# EAGLE design NSL_Kraken (EAGLE 5.11)
MPN: MCL-S250SRC; OC_NEWARK: 14N9351
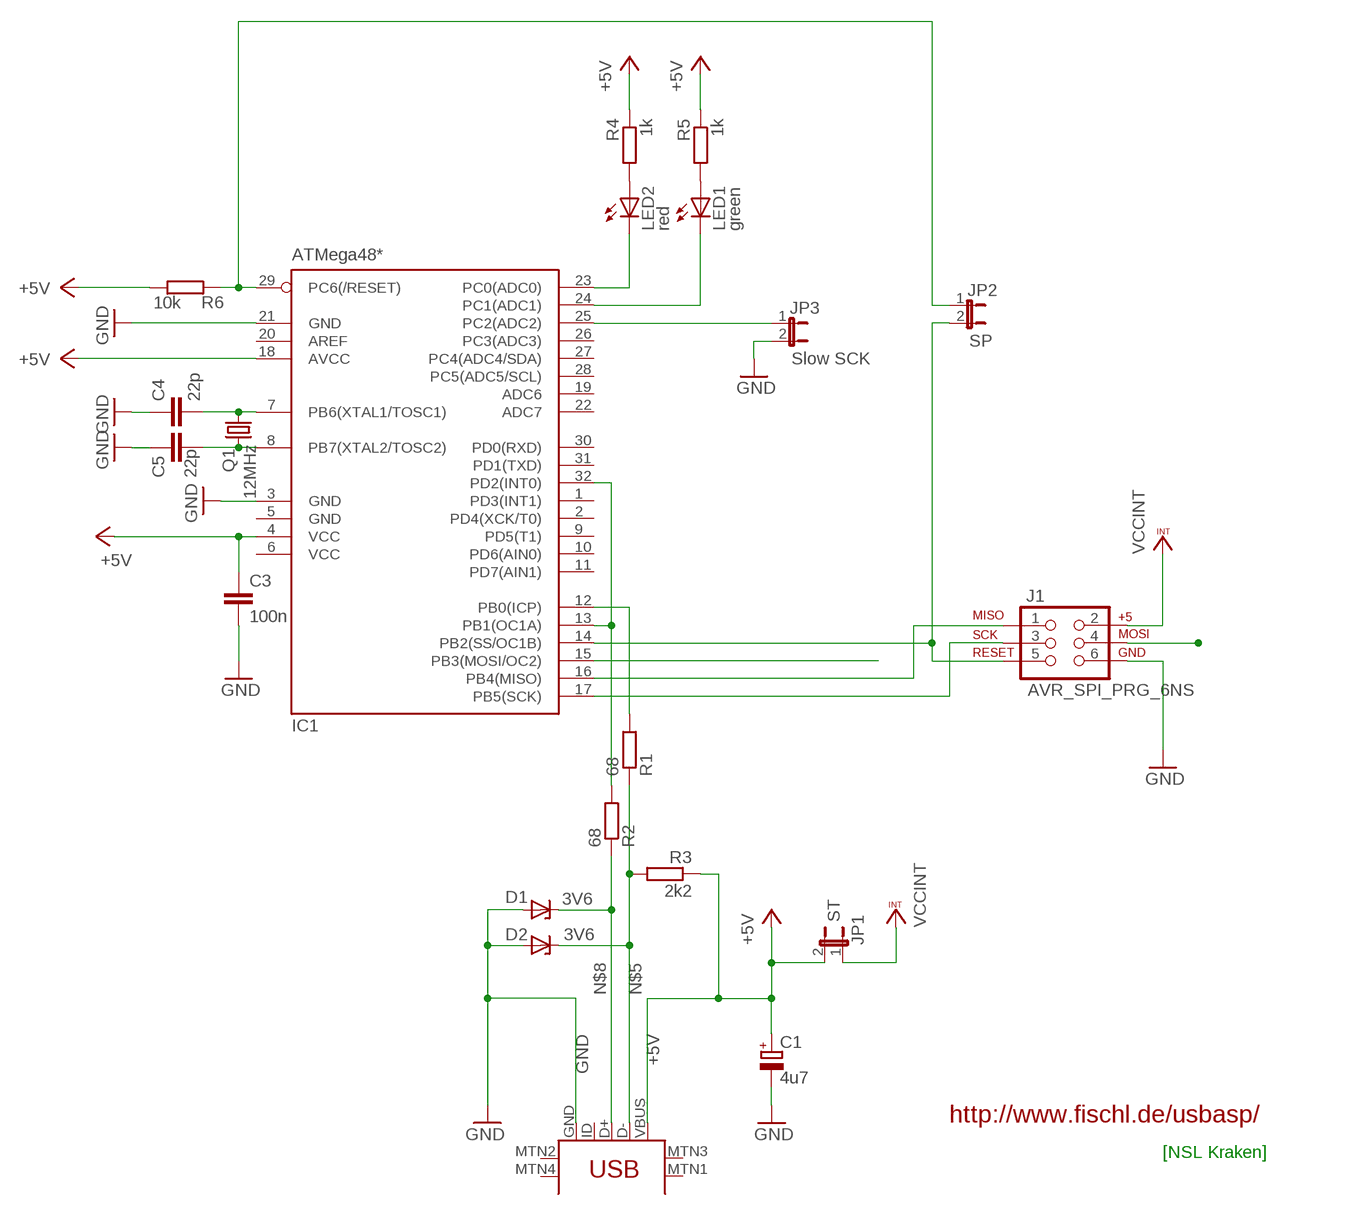
[diagram p0: schematic, sheet 1]

## Parts
C1  4u7  CPOL-EUR/2012-12R  [R/2012-12R]
C3  100n  C-EUC0805  [C0805]
C4  22p  C-EUC0805  [C0805]
C5  22p  C-EUC0805  [C0805]
D1  3V6  ZENER-DIODESOD80C  [SOD80C]
D2  3V6  ZENER-DIODESOD80C  [SOD80C]
IC1  ATMega48*  MEGA8-AI  [TQFP32-08]
J1  AVR_SPI_PRG_6NS  [2X3-NS]
JP1  ST  JP1E  [JP1]
JP2  SP  JP1E  [JP1]
JP3  Slow SCK  JP1E  [JP1]
LED1  green  LEDSMT1206  [1206]
LED2  red  LEDSMT1206  [1206]
Q1  12MHz  CRYTALSM49  [SM49]
R1  68  R-EU_R0805  [R0805]
R2  68  R-EU_R0805  [R0805]
R3  2k2  R-EU_R0805  [R0805]
R4  1k  R-EU_R0805  [R0805]
R5  1k  R-EU_R0805  [R0805]
R6  10k  R-EU_R0805  [R0805]
U$1  USB-MINIB-5PIN  [USB-MINIB]

## Nets
+5V: C1.+ C3.1 IC1.4(VCC) IC1.18(AVCC) JP1.2 R3.1 R4.1 R5.1 R6.1 U$1.VBUS
GND: C1.- C3.2 C4.1 C5.1 D1.A D2.A IC1.3(GND) IC1.21(GND) J1.6 JP3.2 U$1.GND
MISO: IC1.16(PB4(MISO)) J1.1
MOSI: IC1.15(PB3(MOSI/OC2)) J1.4
N$1: IC1.29(PC6(/RESET)) JP2.1 R6.2
N$5: D2.C R1.1 R3.2 U$1.D-
N$7: IC1.13(PB1(OC1A)) IC1.32(PD2(INT0)) R2.2
N$8: D1.C R2.1 U$1.D+
N$12: IC1.25(PC2(ADC2)) JP3.1
N$13: LED2.A R4.2
N$14: IC1.23(PC0(ADC0)) LED2.C
N$15: IC1.24(PC1(ADC1)) LED1.C
N$16: IC1.12(PB0(ICP)) R1.2
N$22: C4.2 IC1.7(PB6(XTAL1/TOSC1)) Q1.2
N$23: C5.2 IC1.8(PB7(XTAL2/TOSC2)) Q1.1
N$25: LED1.A R5.2
RST: IC1.14(PB2(SS/OC1B)) J1.5 JP2.2
SCK: IC1.17(PB5(SCK)) J1.3
VCCINT: J1.2 JP1.1
Unconnected: IC1.1(PD3(INT1)) IC1.2(PD4(XCK/T0)) IC1.9(PD5(T1)) IC1.10(PD6(AIN0)) IC1.11(PD7(AIN1)) IC1.19(ADC6) IC1.20(AREF) IC1.22(ADC7) IC1.26(PC3(ADC3)) IC1.27(PC4(ADC4/SDA)) IC1.28(PC5(ADC5/SCL)) IC1.30(PD0(RXD)) IC1.31(PD1(TXD)) U$1.ID U$1.MTN1(MTN2) U$1.MTN2(MTN3) U$1.MTN3(MTN1) U$1.MTN4

## Notes on the sheet
- http://www.fischl.de/usbasp/
- [NSL Kraken]

## Power pins joined to a net without a drawn wire
GND: IC1.5(GND)
VCC: IC1.6(VCC)

## Library data of the parts
C1 = rcl:CPOL-EU: POLARIZED CAPACITOR, European symbol
C3-C5 = rcl:C-EU: CAPACITOR, European symbol
D1 D2 = diode:ZENER-DIODE: Z-Diode
IC1 = atmel:MEGA8: MICROCONTROLLER 8 Kbytes FLASH, 1 kbytes SRAM, 512 bytes EEPROM, USART, 6-channel 10 bit ADC, 2-channel 8 bit ADC Pin compatible with Atmega48, ATMega88, ATMega168 Source: avr.lbr; MPN: ATMEGA8-16AU; OC_FARNELL: 9171371; OC_NEWARK: 73M8863
J1 = SparkFun:AVR_SPI_PRG_6: AVR ISP 6 Pin This is the reduced ISP connector for AVR programming. Common on Arduino. This footprint will take up less PCB space and can be used with a 10-pin to 6-pin adapter such as SKU: BOB-08508
JP1-JP3 = jumper:JP1E: JUMPER
LED1 LED2 = led:LED: LED OSRAM: - CHIPLED LG R971, LG N971, LY N971, LG Q971, LY Q971, LO R971, LY R971 LH N974, LH R974 LS Q976, LO Q976, LY Q976 LO Q996 - Hyper CHIPLED LW Q18S LB Q993, LB Q99A, LB R99A - SideLED LS A670, LO A670, LY A670, LG A670, LP A670 LB A673, LV A673, LT A673, LW A673 LH A674 LY A675 LS A676, LA A676, LO A676, LY A676, LW A676 LS A679, LY A679, LG A679 - Hyper Micro SIDELED® LS Y876, LA Y876, LO Y876, LY Y876 LT Y87S - SmartLED LW L88C, LW L88S LB L89C, LB L89S, LG L890 LS L89K, LO L89K, LY L89K LS L896, LA L896, LO L896, LY L896 - TOPLED LS T670, LO T670, LY T670, LG T670, LP T670 LSG T670, LSP T670, LSY T670, LOP T670, LYG T670 LG T671, LOG T671, LSG T671 LB T673, LV T673, LT T673, LW T673 LH T674 LS T676, LA T676, LO T676, LY T676, LB T676, LH T676, LSB T676, LW T676 LB T67C, LV T67C, LT T67C, LS T67K, LO T67K, LY T67K, LW E67C LS E67B, LA E67B, LO E67B, LY E67B, LB E67C, LV E67C, LT E67C LW T67C LS T679, LY T679, LG T679 LS T770, LO T770, LY T770, LG T770, LP T770 LB T773, LV T773, LT T773, LW T773 LH T774 LS E675, LA E675, LY E675, LS T675 LS T776, LA T776, LO T776, LY T776, LB T776 LHGB T686 LT T68C, LB T68C - Hyper Mini TOPLED® LB M676 - Mini TOPLED Santana® LG M470 LS M47K, LO M47K, LY M47K Source: http://www.osram.convergy.de LUXEON: - LUMILED® LXK2-PW12-R00, LXK2-PW12-S00, LXK2-PW14-U00, LXK2-PW14-V00 LXK2-PM12-R00, LXK2-PM12-S00, LXK2-PM14-U00 LXK2-PE12-Q00, LXK2-PE12-R00, LXK2-PE12-S00, LXK2-PE14-T00, LXK2-PE14-U00 LXK2-PB12-K00, LXK2-PB12-L00, LXK2-PB12-M00, LXK2-PB14-N00, LXK2-PB14-P00, LXK2-PB14-Q00 LXK2-PR12-L00, LXK2-PR12-M00, LXK2-PR14-Q00, LXK2-PR14-R00 LXK2-PD12-Q00, LXK2-PD12-R00, LXK2-PD12-S00 LXK2-PH12-R00, LXK2-PH12-S00 LXK2-PL12-P00, LXK2-PL12-Q00, LXK2-PL12-R00 Source: www.luxeon.com KINGBRIGHT: KA-3528ASYC Source: www.kingbright.com
Q1 = crystal:CRYTAL: CRYSTAL
R1-R6 = rcl:R-EU_: RESISTOR, European symbol
U$1 = SparkFun:USB-MINIB: Mini-USB "B" connector with 5th pin broken out. Created new symbol breaking out 5th "ID" pin in mini/micro USB connector spec. See: http://en.wikipedia.org/wiki/Mini_usb#Cables. Uses same footprint as 4-pin symbol. Also added pins to connect to mounting / shield pads if required (probably not generally needed as signals aren't shielded once they leave the connector).

## Net classes
0 default: width 0.254 mm

## Board
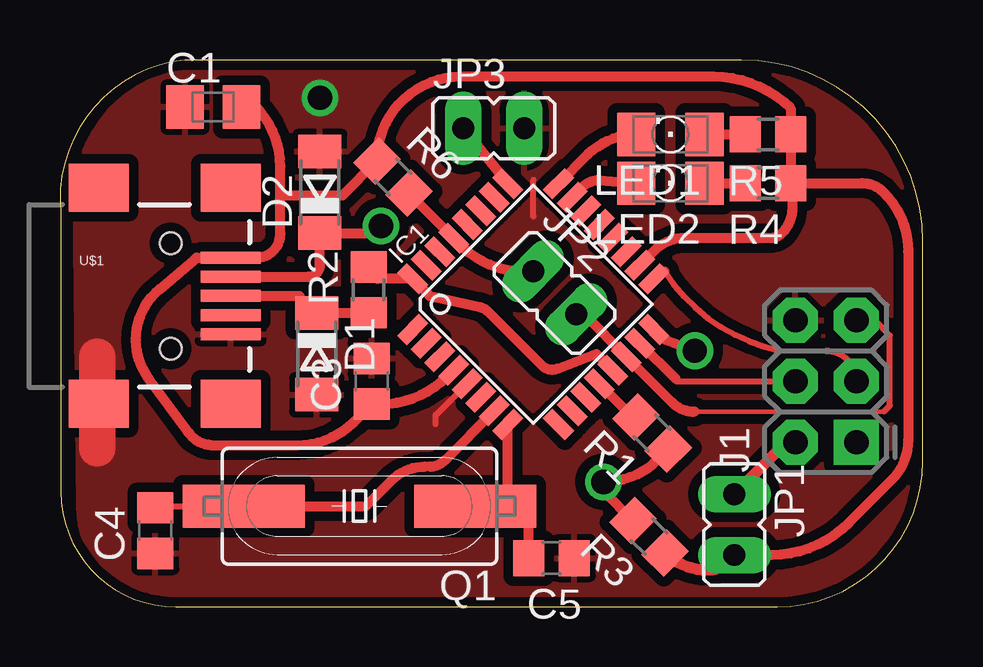
[diagram p1: board, top side]
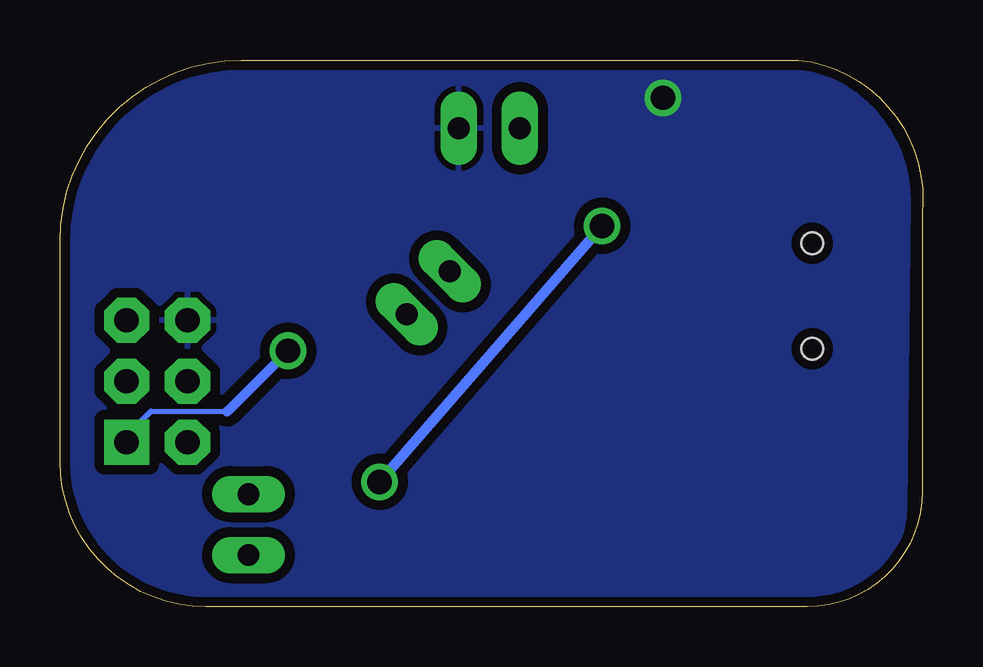
[diagram p2: board, bottom side, seen from below]

Size 35.95 x 22.78 mm. Coordinates in mm from the lower left corner, seen from the top.
Outline: 29.88,0 arc90 35.95,6.07 35.95,15.22 arc90 28.39,22.78 5.19,22.78 arc90 0.03,16.35 0.03,4.79 arc90 4.83,0 29.88,0
Copper layers (1*16): Top 0.0356mm / dielectric 1.5011mm / Bottom 0.0356mm
Design rules "SparkFun-mod *": minimum track width 8mil, minimum drill 32mil, track to track 12mil, track to pad 12mil, pad to pad 8mil, via to via 8mil, smd to smd 8mil, copper to edge 12mil, drill to drill 8mil, minimum pad ring 12mil, minimum via ring 10mil, stop-mask expansion 4mil, vias tented up to drill 25mil, thermal gap 10mil
Milling: 8 lines

### Footprints (pad centres in the part's own frame; a part is rotated, then mirrored left to right if it is on the bottom)
R/2012-12R = smd 1.55 x 1.8: + 1.175,0; - -1.175,0
C0805 = smd 1.3 x 1.5: 1 -0.95,0; 2 0.95,0
SOD80C = smd 1.4 x 1.8: A 1.7,0; C -1.7,0
TQFP32-08 = smd 1.27 x 0.559: 1 -4.293,2.8; 2 -4.293,2; 3 -4.293,1.2; 4 -4.293,0.4; 5 -4.293,-0.4; 6 -4.293,-1.2; 7 -4.293,-2; 8 -4.293,-2.8; 17 4.293,-2.8; 18 4.293,-2; 19 4.293,-1.2; 20 4.293,-0.4; 21 4.293,0.4; 22 4.293,1.2; 23 4.293,2; 24 4.293,2.8 | smd 0.559 x 1.27: 9 -2.8,-4.293; 10 -2,-4.293; 11 -1.2,-4.293; 12 -0.4,-4.293; 13 0.4,-4.293; 14 1.2,-4.293; 15 2,-4.293; 16 2.8,-4.293; 25 2.8,4.293; 26 2,4.293; 27 1.2,4.293; 28 0.4,4.293; 29 -0.4,4.293; 30 -1.2,4.293; 31 -2,4.293; 32 -2.8,4.293
2X3-NS = drill 1.016 pad 1.88 square: 1 -2.54,-1.27 | drill 1.016 pad 1.88 octagon: 2 -2.54,1.27; 3 0,-1.27; 4 0,1.27; 5 2.54,-1.27; 6 2.54,1.27
JP1 = drill 0.914 long: 1 0,-1.27; 2 0,1.27
1206 = smd 1.6 x 1.803: A -1.422,0; C 1.422,0
SM49 = smd 5.08 x 1.778: 1 -4.826,0; 2 4.826,0
R0805 = smd 1.3 x 1.5: 1 -0.95,0; 2 0.95,0
USB-MINIB = smd 2.5 x 0.5: D+ 2.5,0; D- 2.5,0.8; GND 2.5,-1.6; ID 2.5,-0.8; VBUS 2.5,1.6 | smd 2.5 x 2: MTN1 -3,4.5; MTN2 2.5,4.5; MTN3 -3,-4.5; MTN4 2.5,-4.5 | hole 0.9: 0,2.2; 0,-2.2

### Placement (x,y rotation side)
C1  6.38,20.83 0 top
C3  12.99,9.4 90 top
C4  3.97,3.18 90 top
C5  20.48,2.03 180 top
D1  10.7,10.54 270 top
D2  10.83,17.27 90 top
IC1  19.72,12.61 45 top
J1  31.91,9.4 90 top
JP1  28.1,3.43 180 top
JP2  20.61,13.08 225 top
JP3  18.07,19.94 270 top
LED1  25.43,19.69 180 top
LED2  25.43,17.65 180 top
Q1  12.48,4.19 180 top
R1  24.67,7.24 135 top
R2  12.86,13.21 90 top
R3  24.54,2.92 135 top
R4  29.5,17.65 180 top
R5  29.5,19.69 180 top
R6  13.88,17.91 315 top
U$1  4.61,12.95 0 top

### Tracks (layer width: path | path; a pad name or v marks a point on that pad's centre or on a via)
+5V
  Top 0.254: 16.5,9.86 IC1.4 16.14,9.6 | C3.1 13.35,8.45 | R4.1 30.51,17.59 | U$1.VBUS 8.2,14.55 | IC1.18 24.16,14.25 24.27,14.35
  Top 0.406: U$1.VBUS 5.7,14.55 4.15,13.24 arc50 3.16,11.12 arc36 3.68,9.53 5.34,7.27 arc54 6.4,6.73 9.88,6.73 arc45 12.26,7.72 C3.1 | 13.35,8.45 arc45 16.14,9.6 | C1.+ 8.16,20.83 arc-45 9.18,18.38 9.18,17.15 | 9.18,17.15 11.77,17.15 R6.1 arc-90 16.72,22.1 27.23,22.1 arc-45 30.45,20.77 R5.1 R4.1 33.42,17.65 arc-45 34.31,17.29 arc-45 35.34,14.8 35.34,6.95 arc-45 34.64,5.27 32.86,3.49 arc-45 29.64,2.16 JP1.2 27.82,1.88 | 30.51,17.59 30.51,16.63 arc-45 30.07,15.56 arc-45 29.61,15.37 26.04,15.37 arc45 24.75,14.83 24.27,14.35 | 9.18,17.15 9.18,15.53 arc-90 8.2,14.55
  Top 0.457: 27.82,1.88 arc-45 26.97,1.52 arc-45 R3.1
GND  (via drill 1.02)
  Top 0.254: 19.72,16.26 19.72,17.78 | D1.A 10.75,9.14 | 15.83,10.34 IC1.3 | 16.54,8.87 IC1.5 15.65,7.98 15.65,7.62
  Top 1.524: 1.56,6.6 1.56,10.41
  other vias: 10.83,21.21
  pour Top (isolate 0.406): 35.54,15.76 arc89 28.73,22.48 6.17,22.48 arc91 0.61,16.85 0.75,4.17 arc89 4.72,0.25 31.01,0.25 arc91 35.66,4.95
  pour Bottom (isolate 0.406): 35.41,16.4 arc89 29.26,22.47 6.17,22.48 arc91 0.61,16.85 0.75,4.18 arc89 4.71,0.26 30.96,0.26 arc91 35.54,4.88
MISO  (via drill 1.02)
  Top 0.406: IC1.16 25.11,11.18 v26.45,10.67
  Bottom 0.203: 28.99,8.13 32.16,8.13
  Bottom 0.254: 32.16,8.13 33.18,7.11 J1.1
  Bottom 0.406: v26.45,10.67 28.99,8.13
MOSI
  Top 0.254: 25.65,9.51 25.65,9.44 25.69,9.4 J1.4
  Top 0.406: IC1.15 25.65,9.51
N$1
  Top 0.254: 16.79,14.97 IC1.29 16.4,15.39 | 19.55,13.98 JP2.1 | R6.2 14.55,17.21
  Top 0.406: 16.79,14.97 arc45 19.55,13.98 | 14.55,17.21 IC1.29
N$5  (via drill 1.02)
  Top 0.406: 23.57,3.72 R3.2 22.64,4.83 v22.64,5.21 arc45 24.93,6.16 R1.1 | U$1.D- 10.36,13.75 arc90 10.83,14.22 D2.C 13.07,15.57 v13.37,15.88
  Bottom 0.406: v13.37,15.88 v22.64,5.21
N$7
  Top 0.254: IC1.32
  Top 0.406: IC1.32 15.4,12.95 17.47,12.5 arc-32 17.85,12.29 20.06,10.07 arc66 20.74,9.93 22.35,10.54 IC1.13 | R2.2 13.23,13.67 IC1.32
N$8
  Top 0.254: 10.46,12.26 D1.C 9.99,12.95
  Top 0.406: 10.46,12.26 R2.1 | U$1.D+ 9.99,12.95
N$12
  Top 0.406: JP3.1 IC1.25
N$13
  Top 0.406: LED2.A R4.2
N$14
  Top 0.406: IC1.23 21.75,17.48 arc-45 22.49,17.78 LED2.C
N$15
  Top 0.406: IC1.24 21.99,18.85 arc-45 LED1.C
N$16
  Top 0.254: 23.85,7.91 R1.2
  Top 0.406: IC1.12 23.85,7.91
N$22
  Top 0.254: C4.2 4.04,4.19 Q1.2 | 15.21,5.84 15.4,5.84
  Top 0.406: Q1.2 12.73,4.19 13.8,5.26 arc-45 15.21,5.84 | 15.4,5.84 arc45 16.04,6.11 IC1.7
N$23
  Top 0.254: 19.53,4.19 19.08,4.19 18.66,4.62
  Top 0.406: C5.2 19.53,4.19 | 19.08,4.19 Q1.1 | 18.66,4.62 IC1.8
N$25
  Top 0.406: LED1.A R5.2
RST
  Top 0.178: 26.43,8.13 34.32,8.13
  Top 0.254: JP2.2 21.84,12.18 | 34.32,8.13 34.58,8.38 34.58,11.3 33.94,11.94 J1.5
  Top 0.406: 21.84,12.18 IC1.14 25.52,8.51 arc45 26.43,8.13
SCK
  Top 0.178: 30.01,10.67 31.91,10.67
  Top 0.254: 25.19,13.97 arc45 30.01,10.67 | 31.91,10.67 arc-90 J1.3
  Top 0.406: IC1.17 25.19,13.97
VCCINT
  Top 0.254: 30.26,6.86 J1.2
  Top 0.457: JP1.1 30.26,6.86

### Text on the board
_tsilk: charliex | + | b | - | - | 032.la | 1 | a | NSL Kraken